# Altium schematic sheet Vario_sch.SchDoc
size C
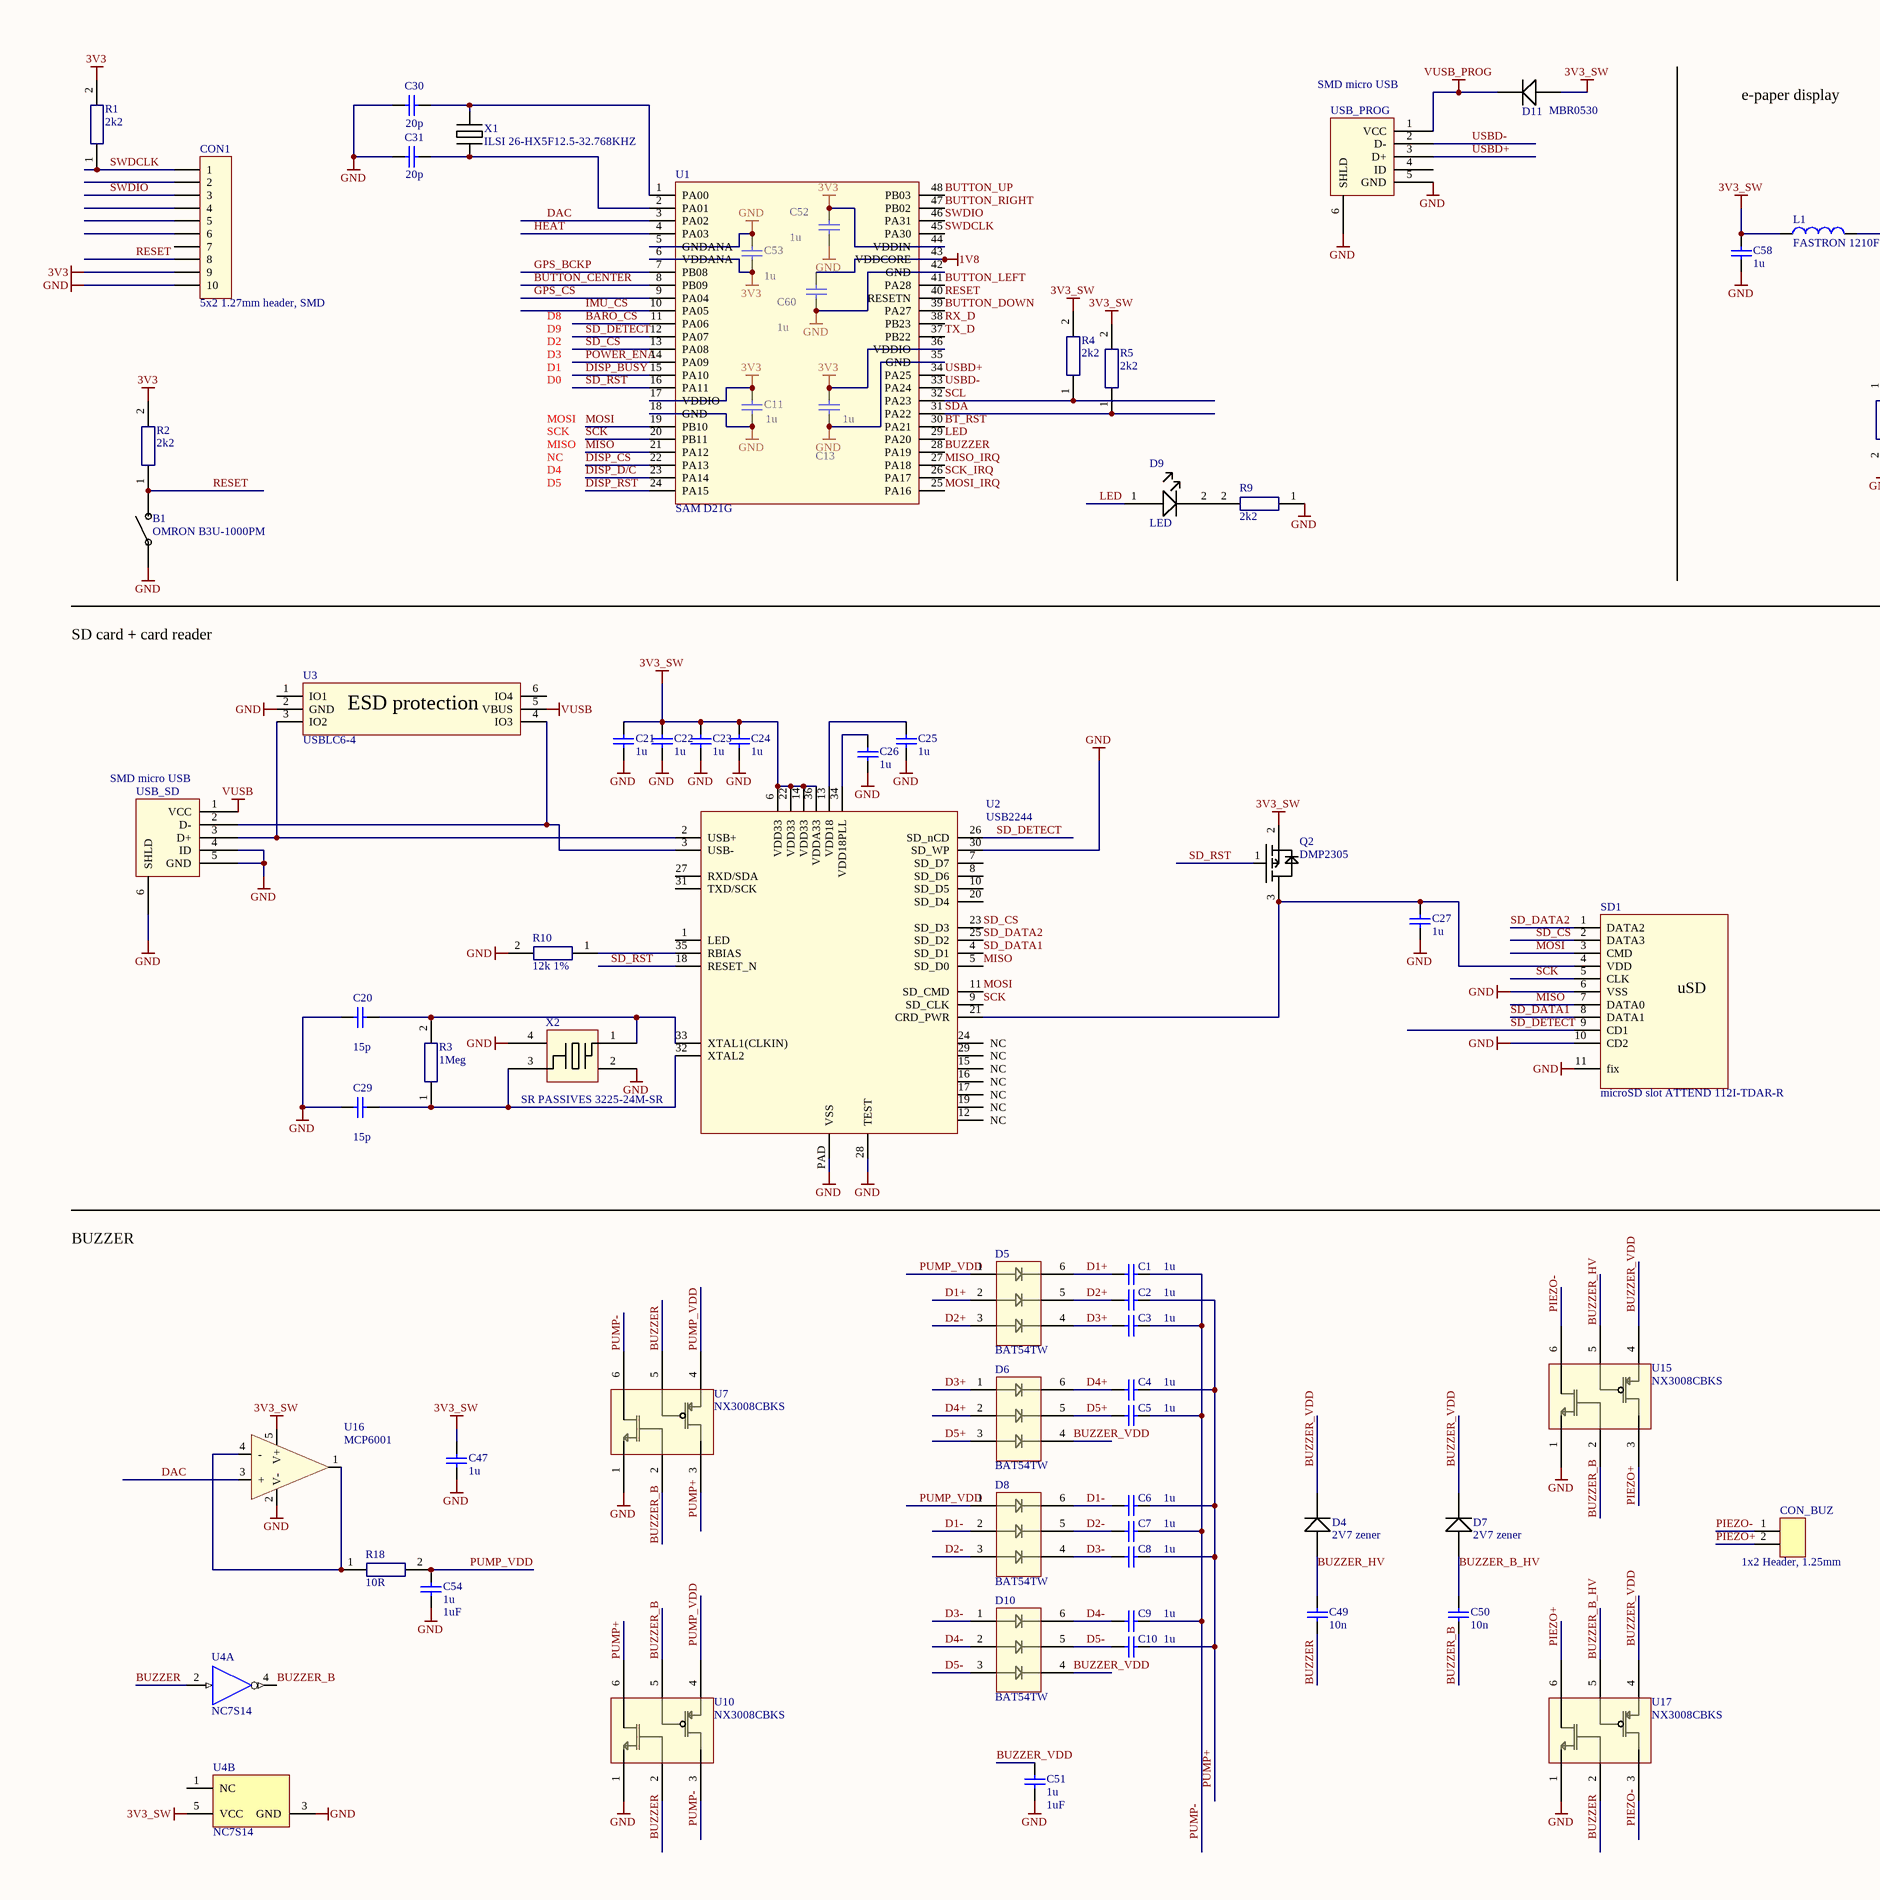
[diagram p0: Vario_sch.SchDoc, left]
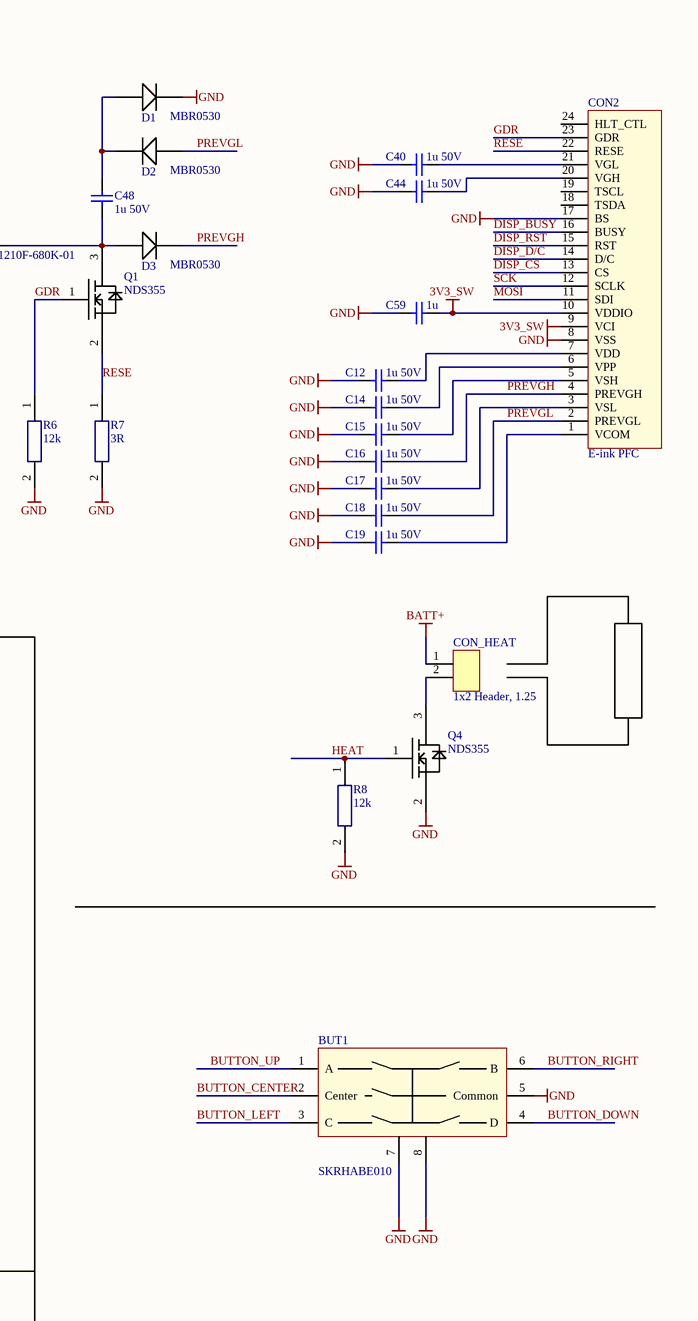
[diagram p1: Vario_sch.SchDoc, right]

## Parts
B1  OMRON B3U-1000PM  [tlacitecko]
BUT1  SKRHABE010  [SKRHABE010]
C1  1u  [cap0603]
C2  1u  [cap0603]
C3  1u  [cap0603]
C4  1u  [cap0603]
C5  1u  [cap0603]
C6  1u  [cap0603]
C7  1u  [cap0603]
C8  1u  [cap0603]
C9  1u  [cap0603]
C10  1u  [cap0603]
C11  1u  [cap0603]
C12  1u 50V  [cap0603]
C13  1u  [cap0603]
C14  1u 50V  [cap0603]
C15  1u 50V  [cap0603]
C16  1u 50V  [cap0603]
C17  1u 50V  [cap0603]
C18  1u 50V  [cap0603]
C19  1u 50V  [cap0603]
C20  15p  [cap0603]
C21  1u  [cap0603]
C22  1u  [cap0603]
C23  1u  [cap0603]
C24  1u  [cap0603]
C25  1u  [cap0603]
C26  1u  [cap0603]
C27  1u  [cap0603]
C29  15p  [cap0603]
C30  20p  [cap0603]
C31  20p  [cap0603]
C40  1u 50V  [cap0603]
C44  1u 50V  [cap0603]
C47  1u  [cap0603]
C48  1u 50V  [cap0603]
C49  10n  [cap0603]
C50  10n  [cap0603]
C51  1u  value 1uF  [cap0603]
C52  1u  [cap0603]
C53  1u  [cap0603]
C54  1u  value 1uF  [cap0603]
C58  1u  [cap0603]
C59  1u  [cap0603]
C60  1u  [cap0603]
CON1  5x2 1.27mm header, SMD  [2x5, 1.27, SMD]
CON2  E-ink PFC  [24 way PFC connector]
CON_BUZ  1x2 Header, 1.25mm  [1x2, 1.25]
CON_HEAT  1x2 Header, 1.25  [1x2, 1.25]
D1  MBR0530  [MiniMELF]
D2  MBR0530  [MiniMELF]
D3  MBR0530  [MiniMELF]
D4  2V7 zener  [Micromelf]
D5  BAT54TW  [SC70]
D6  BAT54TW  [SC70]
D7  2V7 zener  [Micromelf]
D8  BAT54TW  [SC70]
D9  LED  [cap0805]
D10  BAT54TW  [SC70]
D11  MBR0530  [MiniMELF]
L1  FASTRON 1210F-680K-01  [res1206]
Q1  NDS355  [sot23-3]
Q2  DMP2305  [sot23-3]
Q4  NDS355  [sot23-3]
R1  2k2  [cap0805]
R2  2k2  [cap0805]
R3  1Meg  [cap0805]
R4  2k2  [cap0805]
R5  2k2  [cap0805]
R6  12k  [cap0805]
R7  3R  [cap0805]
R8  12k  [cap0805]
R9  2k2  [cap0805]
R10  12k 1%  [cap0805]
R18  10R  [cap0805]
SD1  microSD slot ATTEND 112I-TDAR-R  [microSD_slot]
U1  SAM D21G  [48QFP 0.5mm]
U2  USB2244  [qfn36]
U3  USBLC6-4  [sot23-6]
U4  NC7S14  [sot23-5]  (parts A,B of 2)
U7  NX3008CBKS  [SC70]
U10  NX3008CBKS  [SC70]
U15  NX3008CBKS  [SC70]
U16  MCP6001  [sot23-5]
U17  NX3008CBKS  [SC70]
USB_PROG  SMD micro USB  [microusb_smd]
USB_SD  SMD micro USB  [microusb_smd]
X1  ILSI 26-HX5F12.5-32.768KHZ  [crystal]
X2  SR PASSIVES 3225-24M-SR  [crystal 3.2x2.5]

## Nets
1V8: C60.2 U1.43(VDDCORE)
3V3: C11.2 C13.2 C52.1 C53.2 CON1.9 R1.2 R2.2 U1.6(VDDANA) U1.17(VDDIO) U1.36(VDDIO) U1.44(VDDIN)
3V3_SW: C21.2 C22.2 C23.2 C24.2 C47.2 C58.2 C59.2 CON2.9(VCI) CON2.10(VDDIO) D11.A L1.1 Q2.2(S) R4.2 R5.2 U2.6(VDD33) U2.14(VDD33) U2.22(VDD33) U2.36(VDDA33) U4.5(VCC) U16.5(V+)
BATT+: CON_HEAT.1
GND: B1.1 BUT1.5(Common) BUT1.7 BUT1.8 C11.1 C12.1 C13.1 C14.1 C15.1 C16.1 C17.1 C18.1 C19.1 C20.2 C21.1 C22.1 C23.1 C24.1 C25.1 C26.1 C27.1 C29.2 C30.2 C31.2 C40.1 C44.1 C47.1 C51.2 C52.2 C53.1 C54.2 C58.1 C59.1 C60.1 CON1.10 CON2.8(VSS) CON2.17(BS) D1.K Q4.2(D) R6.2 R7.2 R8.2 R9.1 R10.2 SD1.6(VSS) SD1.10(CD2) SD1.11(fix) U1.5(GNDANA) U1.18(GND) U1.35(GND) U1.42(GND) U2.28(TEST) U2.30(SD_WP) U2.PAD(VSS) U3.2(GND) U4.3(GND) U7.1 U10.1 U15.1 U16.2(V-) U17.1 USB_PROG.5(GND) USB_PROG.6(SHLD) USB_SD.4(ID) USB_SD.5(GND) USB_SD.6(SHLD) X2.2 X2.4
VUSB: U3.5(VBUS) USB_SD.1(VCC)
VUSB_PROG: D11.K USB_PROG.1(VCC)
BARO_CS: U1.11(PA06)
BT_RST: U1.30(PA21)
BUTTON_CENTER: BUT1.2(Center) U1.8(PB09)
BUTTON_DOWN: BUT1.4(D) U1.39(PA27)
BUTTON_LEFT: BUT1.3(C) U1.41(PA28)
BUTTON_RIGHT: BUT1.6(B) U1.47(PB02)
BUTTON_UP: BUT1.1(A) U1.48(PB03)
BUZZER: C49.2 U1.28(PA19) U4.2(A) U7.5 U10.2 U17.2
BUZZER_B: C50.2 U4.4(Y) U7.2 U10.5 U15.2
BUZZER_B_HV: C50.1 D7.A U17.5
BUZZER_HV: C49.1 D4.A U15.5
BUZZER_VDD: C51.1 D4.K D6.4 D7.K D10.4 U15.4 U17.4
D1+: C1.1 D5.2 D5.6
D1-: C6.1 D8.2 D8.6
D2+: C2.1 D5.3 D5.5
D2-: C7.1 D8.3 D8.5
D3+: C3.1 D5.4 D6.1
D3-: C8.1 D8.4 D10.1
D4+: C4.1 D6.2 D6.6
D4-: C9.1 D10.2 D10.6
D5+: C5.1 D6.3 D6.5
D5-: C10.1 D10.3 D10.5
DAC: U1.3(PA02) U16.3(+)
DISP_BUSY: CON2.16(BUSY) U1.15(PA10)
DISP_CS: CON2.13(CS) U1.22(PA13)
DISP_D/C: CON2.14(D/C) U1.23(PA14)
DISP_RST: CON2.15(RST) U1.24(PA15)
GDR: CON2.23(GDR) Q1.1(G) R6.1
GPS_BCKP: U1.7(PB08)
GPS_CS: U1.9(PA04)
HEAT: Q4.1(G) R8.1 U1.4(PA03)
IMU_CS: U1.10(PA05)
LED: D9.1 U1.29(PA20)
MISO: SD1.7(DATA0) U1.21(PA12) U2.5(SD_D0)
MISO_IRQ: U1.27(PA18)
MOSI: CON2.11(SDI) SD1.3(CMD) U1.19(PB10) U2.11(SD_CMD)
MOSI_IRQ: U1.25(PA16)
PIEZO+: CON_BUZ.2 U15.3 U17.6
PIEZO-: CON_BUZ.1 U15.6 U17.3
POWER_ENA: U1.14(PA09)
PREVGH: C16.2 CON2.4(PREVGH) D3.K
PREVGL: C18.2 CON2.2(PREVGL) D2.A
PUMP+: C2.2 C4.2 C6.2 C8.2 C10.2 U7.3 U10.6
PUMP-: C1.2 C3.2 C5.2 C7.2 C9.2 U7.6 U10.3
PUMP_VDD: C54.1 D5.1 D8.1 R18.2 U7.4 U10.4
RESE: CON2.22(RESE) Q1.2(D) R7.1
RESET: B1.2 CON1.8 R2.1 U1.40(RESETN)
RX_D: U1.38(PB23)
SCK: CON2.12(SCLK) SD1.5(CLK) U1.20(PB11) U2.9(SD_CLK)
SCK_IRQ: U1.26(PA17)
SCL: R4.1 U1.32(PA23)
SD_CS: SD1.2(DATA3) U1.13(PA08) U2.23(SD_D3)
SD_DATA1: SD1.8(DATA1) U2.4(SD_D1)
SD_DATA2: SD1.1(DATA2) U2.25(SD_D2)
SD_DETECT: SD1.9(CD1) U1.12(PA07) U2.26(SD_nCD)
SD_RST: Q2.1(G) U1.16(PA11) U2.18(RESET_N)
SDA: R5.1 U1.31(PA22)
SWDCLK: CON1.1 R1.1 U1.45(PA30)
SWDIO: CON1.3 U1.46(PA31)
TX_D: U1.37(PB22)
USBD+: U1.34(PA25) USB_PROG.3(D+)
USBD-: U1.33(PA24) USB_PROG.2(D-)
NetC12_2: C12.2 CON2.7(VDD)
NetC14_2: C14.2 CON2.6(VPP)
NetC15_2: C15.2 CON2.5(VSH)
NetC17_2: C17.2 CON2.3(VSL)
NetC19_2: C19.2 CON2.1(VCOM)
NetC20_1: C20.1 R3.2 U2.33(XTAL1(CLKIN)) X2.1
NetC25_2: C25.2 U2.13(VDD18)
NetC26_2: C26.2 U2.34(VDD18PLL)
NetC27_2: C27.2 Q2.3(D) SD1.4(VDD) U2.21(CRD_PWR)
NetC29_1: C29.1 R3.1 U2.32(XTAL2) X2.3
NetC30_1: C30.1 U1.1(PA00) X1.2
NetC31_1: C31.1 U1.2(PA01) X1.1
NetC40_2: C40.2 CON2.21(VGL)
NetC44_2: C44.2 CON2.20(VGH)
NetC48_1: C48.1 D3.A L1.2 Q1.3(S)
NetC48_2: C48.2 D1.A D2.K
NetCON_HEAT_2: CON_HEAT.2 Q4.3(S)
NetD9_2: D9.2 R9.2
NetR10_1: R10.1 U2.35(RBIAS)
NetR18_1: R18.1 U16.1(Out_A) U16.4(-)
NetU2_2: U2.2(USB+) U3.3(IO2) USB_SD.3(D+)
NetU2_3: U2.3(USB-) U3.4(IO3) USB_SD.2(D-)

Not connected (* = marked no-connect by the designer): CON1 2 4 5 6 7; CON2 18(TSDA) 19(TSCL) 24(HLT_CTL); U2 1(LED) 7(SD_D7) 8(SD_D6) 10(SD_D5) 12(NC) 15(NC) 16(NC) 17(NC) 19(NC) 20(SD_D4) 24(NC) 27(RXD/SDA) 29(NC) 31(TXD/SCK); U3 1(IO1) 6(IO4); U4 1(NC); USB_PROG 4(ID)

## Notes on the sheet
- e-paper display
- D2
- D8
- D9
- D0
- D1
- D3
- D4
- SCK
- MISO
- MOSI
- NC
- D5
- SD card + card reader
- BUZZER
- (in symbol microSD slot) uSD

## Library data of the parts
B1 = button
BUT1 = SKRHABE010: 5-way joystick
C1-C10 = Cap: 0603; Value: 1uF; Published: 8-Jun-2000; LatestRevisionDate: 17-Jul-2002; LatestRevisionNote: Re-released for DXP Platform.; PackageReference: RAD-0.3; Publisher: Altium Limited; PackageDescription: Radial Cap, Thru-Hole; 2 Leads; 0.3 in Pin Spacing
C11-C27 C29-C31 C40 C44 C47-C54 C58-C60 = Cap: 0603; Published: 8-Jun-2000; LatestRevisionDate: 17-Jul-2002; LatestRevisionNote: Re-released for DXP Platform.; PackageReference: RAD-0.3; Publisher: Altium Limited
  C11 C13 C21-C27 C47 C52 C53 C58-C60: PackageDescription: Radial Cap, Thru-Hole; 2 Leads; 0.3 in Pin Spacing; Value: 1u
  C12 C14-C19 C40 C44 C48: PackageDescription: Radial Cap, Thru-Hole; 2 Leads; 0.3 in Pin Spacing; Value: 1u 50V
  C20: PackageDescription: 0603; Value: 15p
  C29: PackageDescription: Radial Cap, Thru-Hole; 2 Leads; 0.3 in Pin Spacing; Value: 15p
  C30 C31: PackageDescription: Radial Cap, Thru-Hole; 2 Leads; 0.3 in Pin Spacing; Value: 20p
  C49 C50: PackageDescription: Radial Cap, Thru-Hole; 2 Leads; 0.3 in Pin Spacing; Value: 10n
  C51 C54: PackageDescription: Radial Cap, Thru-Hole; 2 Leads; 0.3 in Pin Spacing
CON1 = 5x2 1.27mm: programming connector for uC
CON2 = E-ink PFC: OMRON XF2W24151AR100
CON_BUZ = 1x2 Header, 2.54
CON_HEAT = 1x2 Header, 2.54: 90deg angle
D1-D3 D11 = DB27308: SOD−123 shottky diode
D4 D7 = DB27308: micromelf
L1 = Inductor1: 1210F-680K-01; Value: =Value
Q1 Q4 = BSS138: N-FET transistor
Q2 = NX3008: P-FET transistor
R1-R10 R18 = Resistor1: 0805; Value: =Value
SD1 = microSD slot: ATTEND 112I-TDAR-R; pin to pad: 9>CD1 10>CD2 11>fix
U1 = SAM D21G: Atmel ARM M0+ uC
U2 = USB2244: SD card reader
U3 = USBLC6-4: ESD protection
U4 = SN74LVC1G04DBVR: SOT23-5 single Inverter; Manufacturer: Texas Instruments; VCC(Min)(V): 1.65; VCC(Max)(V): 5.5; Output Type: CMOS; ICC @ Nom Voltage(Max)(mA): 0.01; Input Type: CMOS/TTL; Bits(#): 1; F @ Nom Voltage(Max)(Mhz): 150; Rating: Catalog; Technology Family: LVC; Voltage(Nom)(V): 1.8,2.5,3.3,5; Schmitt Trigger: No; Output Drive (IOL/IOH)(Max)(mA): 32/-32; tpd @ Nom Voltage(Max)(ns): 7.5,5.2,4.2,3.7; Logic: Inverting; Sub-Family: Inverting Buffer/Driver; PackageReference: DBV0005A; Supplier 1: Mouser; Supplier Part Number 1: 595-SN74LVC1G04DBVR; Supplier 2: Digi-Key; Supplier Part Number 2: 296-11599-2-ND; Supplier 3: Digi-Key; Supplier Part Number 3: 296-11599-1-ND; Supplier 4: Digi-Key; Supplier Part Number 4: 296-11599-6-ND; Generic Part Number: SN74LVC1G04; Operating Temperature Range(C): -40 to 125,-40 to 85; 3-State Output: No; PartNumber: SN74LVC1G04DBVR; ComponentLink1Description: Manufacturer URL; ComponentLink1URL: http://www.ti.com/; ComponentLink2Description: Datasheet; ComponentLink2URL: http://www.ti.com/lit/ds/symlink/sn74lvc1g04.pdf
U7 U10 U15 U17 = NX3008CBKS: SC70 N/P dual mos
U16 = MCP601: SOT23 R-R opamp
USB_PROG USB_SD = micro USB
X1 = Crystal
X2 = Crystal_smd